# EAGLE design OSO-PYCO-A1-02 (EAGLE 9.6.2)
CHECKED: KTOWN; COMPANY: ADAFRUIT INDUSTRIES; DRAWN: KTOWN; REV: A

## Sheet 1 of 2
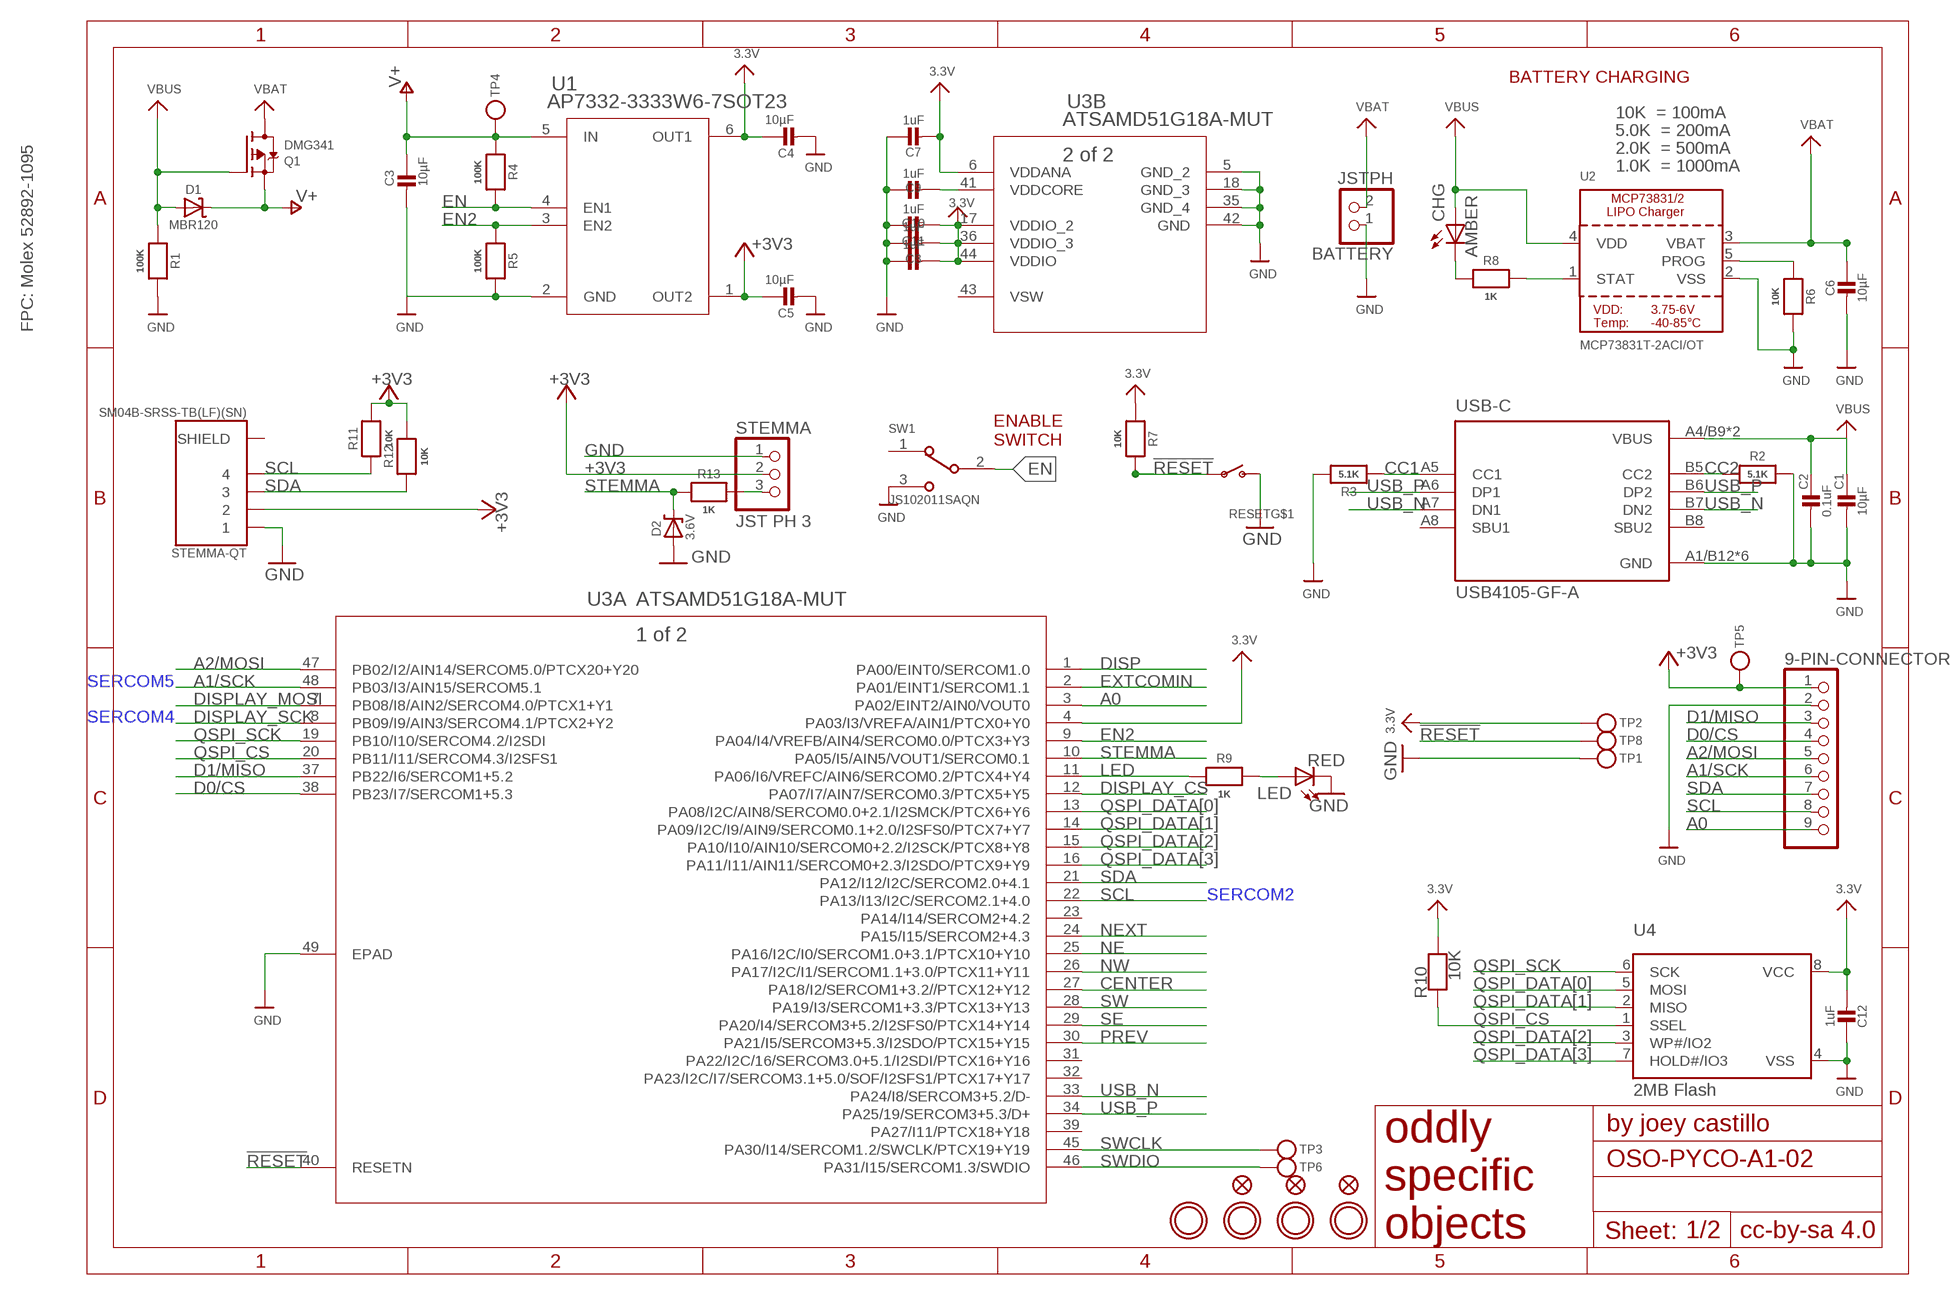
[diagram p0: schematic, sheet 1]

### Parts
9-PIN-CONNECTOR  HEADER-1X9_JSTSH  [JST_SH9]
BATTERY  JSTPH  CON_JST_PH_2PIN  [JSTPH2]
C1  10µF  CAP_CERAMIC0805-NOOUTLINE  [0805-NO]
C2  0.1uF  CAP_CERAMIC_0603MP  [_0603MP]
C3  10µF  CAP_CERAMIC0805-NOOUTLINE  [0805-NO]
C4  10µF  CAP_CERAMIC0805-NOOUTLINE  [0805-NO]
C5  10µF  CAP_CERAMIC0805-NOOUTLINE  [0805-NO]
C6  10µF  CAP_CERAMIC0805-NOOUTLINE  [0805-NO]
C7  1uF  CAP_CERAMIC_0603MP  [_0603MP]
C8  1uF  CAP_CERAMIC_0603MP  [_0603MP]
C9  1uF  CAP_CERAMIC_0603MP  [_0603MP]
C10  1uF  CAP_CERAMIC_0603MP  [_0603MP]
C11  1uF  CAP_CERAMIC_0603MP  [_0603MP]
C12  1uF  CAP_CERAMIC_0603MP  [_0603MP]
CHG  AMBER  LEDCHIP-LED0805  [CHIP-LED0805]
D1  MBR120  DIODE-SCHOTTKYSOD-123  [SOD-123]
D2  3.6V  DIODE-ZENERSOD123  [SOD-123]
FID1  FIDUCIAL_1MM  [FIDUCIAL_1MM]
FID2  FIDUCIAL_1MM  [FIDUCIAL_1MM]
FID3  FIDUCIAL_1MM  [FIDUCIAL_1MM]
LED  RED  LEDCHIP-LED0805  [CHIP-LED0805]
Q1  DMG341  MOSFET-P  [SOT23-R]
R1  100K  RESISTOR_0603MP  [_0603MP]
R2  5.1K  RESISTOR_0603MP  [_0603MP]
R3  5.1K  RESISTOR_0603MP  [_0603MP]
R4  100K  RESISTOR_0603MP  [_0603MP]
R5  100K  RESISTOR_0603MP  [_0603MP]
R6  10K  RESISTOR_0603MP  [_0603MP]
R7  10K  RESISTOR_0603MP  [_0603MP]
R8  1K  RESISTOR_0603MP  [_0603MP]
R9  1K  RESISTOR_0603MP  [_0603MP]
R10  10K  RESISTOR_0603MP  [_0603MP]
R11  10K  RESISTOR_0603MP  [_0603MP]
R12  10K  RESISTOR_0603MP  [_0603MP]
R13  1K  RESISTOR_0603MP  [_0603MP]
RESET  SWITCH_SPSTTL3330A  [TL3330A]
STEMMA  JST PH 3  CON_JST_PH_3PIN  [JSTPH3]
STEMMA-QT  SM04B-SRSS-TB(LF)(SN)  [JST_SM04B-SRSS-TB(LF)(SN)]
SW1  JS102011SAQN  [SW_JS102011SAQN]
TP1  TESTPOINTROUND2MMNO  [TESTPOINT_ROUND_2MM_NO]
TP2  TESTPOINTROUND2MMNO  [TESTPOINT_ROUND_2MM_NO]
TP3  TESTPOINTROUND2MMNO  [TESTPOINT_ROUND_2MM_NO]
TP4  TESTPOINTROUND2MMNO  [TESTPOINT_ROUND_2MM_NO]
TP5  TESTPOINTROUND2MMNO  [TESTPOINT_ROUND_2MM_NO]
TP6  TESTPOINTROUND2MMNO  [TESTPOINT_ROUND_2MM_NO]
TP8  TESTPOINTROUND2MMNO  [TESTPOINT_ROUND_2MM_NO]
U1  AP7332-3333W6-7SOT23  [SOT23-6]
U2  MCP73831T-2ACI/OT  MCP73831/2  [SOT23-5]
U3  ATSAMD51G18A-MUT  [QFN48_7X7MC]
U4  2MB Flash  SPIFLASH_SOIC8  [SOIC8_150MIL]
U$9  MOUNTINGHOLE2.5  [MOUNTINGHOLE_2.5_PLATED]
U$10  MOUNTINGHOLE2.5  [MOUNTINGHOLE_2.5_PLATED]
U$27  MOUNTINGHOLE2.5  [MOUNTINGHOLE_2.5_PLATED]
U$28  MOUNTINGHOLE2.5  [MOUNTINGHOLE_2.5_PLATED]
USB-C  USB4105-GF-A  [GCT_USB4105-GF-A]

### Nets
3.3V [power]: C4.1 C7.2 C8.2 C10.2 C11.2 C12.2 R7.1 R10.2 TP2.P$1 U1.6(OUT1) U3.4(A:PA03/I3/VREFA/AIN1/PTCX0+Y0) U3.6(B:VDDANA) U3.17(B:VDDIO_2) U3.36(B:VDDIO_3) U3.44(B:VDDIO) U4.8(VCC) ; also sheet 2
!RESET: R7.2 RESET.P$1(P) TP8.P$1 U3.40(A:RESETN)
+3V3 [power]: 9-PIN-CONNECTOR.1 C5.1 R11.2 R12.2 STEMMA-QT.2 STEMMA.2 TP5.P$1 U1.1(OUT2)
A0: 9-PIN-CONNECTOR.9 U3.3(A:PA02/EINT2/AIN0/VOUT0)
A1/SCK: 9-PIN-CONNECTOR.6 U3.48(A:PB03/I3/AIN15/SERCOM5.1)
A2/MOSI: 9-PIN-CONNECTOR.5 U3.47(A:PB02/I2/AIN14/SERCOM5.0/PTCX20+Y20)
CC1: R3.1 USB-C.A5(CC1)
CC2: R2.1 USB-C.B5(CC2)
CENTER: U3.27(A:PA18/I2/SERCOM1+3.2//PTCX12+Y12) ; also sheet 2
D0/CS: 9-PIN-CONNECTOR.4 U3.38(A:PB23/I7/SERCOM1+5.3)
D1/MISO: 9-PIN-CONNECTOR.3 U3.37(A:PB22/I6/SERCOM1+5.2)
DISP: U3.1(A:PA00/EINT0/SERCOM1.0) ; also sheet 2
DISPLAY_CS: U3.12(A:PA07/I7/AIN7/SERCOM0.3/PTCX5+Y5) ; also sheet 2
DISPLAY_MOSI: U3.7(A:PB08/I8/AIN2/SERCOM4.0/PTCX1+Y1) ; also sheet 2
DISPLAY_SCK: U3.8(A:PB09/I9/AIN3/SERCOM4.1/PTCX2+Y2) ; also sheet 2
EN: R4.2 SW1.2 U1.4(EN1) ; also sheet 2
EN2: R5.1 U1.3(EN2) U3.9(A:PA04/I4/VREFB/AIN4/SERCOM0.0/PTCX3+Y3)
EXTCOMIN: U3.2(A:PA01/EINT1/SERCOM1.1) ; also sheet 2
GND [gnd]: 9-PIN-CONNECTOR.2 BATTERY.1 C1.2 C2.2 C3.2 C4.2 C5.2 C6.2 C7.1 C8.1 C9.1 C10.1 C11.1 C12.1 D2.A LED.C R1.2 R2.2 R3.2 R5.2 R6.2 RESET.P$2(S) STEMMA-QT.1 STEMMA.1 SW1.3 TP1.P$1 U1.2(GND) U2.2(VSS) U3.5(B:GND_2) U3.18(B:GND_3) U3.35(B:GND_4) U3.42(B:GND) U3.49(A:EPAD) U4.4(VSS) USB-C.A1/B12(GND) USB-C.B1/A12(GND) USB-C.G1(GND) USB-C.G2(GND) USB-C.G3(GND) USB-C.G4(GND) ; also sheet 2
LED: R9.1 U3.11(A:PA06/I6/VREFC/AIN6/SERCOM0.2/PTCX4+Y4)
N$1: LED.A R9.2
N$2: CHG.C R8.1
NE: U3.25(A:PA16/I2C/I0/SERCOM1.0+3.1/PTCX10+Y10) ; also sheet 2
NEXT: U3.24(A:PA15/I15/SERCOM2+4.3) ; also sheet 2
NW: U3.26(A:PA17/I2C/I1/SERCOM1.1+3.0/PTCX11+Y11) ; also sheet 2
PREV: U3.30(A:PA21/I5/SERCOM3+5.3/I2SDO/PTCX15+Y15) ; also sheet 2
PROG: R6.1 U2.5(PROG)
QSPI_CS: R10.1 U3.20(A:PB11/I11/SERCOM4.3/I2SFS1) U4.1(SSEL)
QSPI_DATA[0]: U3.13(A:PA08/I2C/AIN8/SERCOM0.0+2.1/I2SMCK/PTCX6+Y6) U4.5(MOSI)
QSPI_DATA[1]: U3.14(A:PA09/I2C/I9/AIN9/SERCOM0.1+2.0/I2SFS0/PTCX7+Y7) U4.2(MISO)
QSPI_DATA[2]: U3.15(A:PA10/I10/AIN10/SERCOM0+2.2/I2SCK/PTCX8+Y8) U4.3(WP#/IO2)
QSPI_DATA[3]: U3.16(A:PA11/I11/AIN11/SERCOM0+2.3/I2SDO/PTCX9+Y9) U4.7(HOLD#/IO3)
QSPI_SCK: U3.19(A:PB10/I10/SERCOM4.2/I2SDI) U4.6(SCK)
SCL: 9-PIN-CONNECTOR.8 R11.1 STEMMA-QT.4 U3.22(A:PA13/I13/I2C/SERCOM2.1+4.0)
SDA: 9-PIN-CONNECTOR.7 R12.1 STEMMA-QT.3 U3.21(A:PA12/I12/I2C/SERCOM2.0+4.1)
SE: U3.29(A:PA20/I4/SERCOM3+5.2/I2SFS0/PTCX14+Y14) ; also sheet 2
STAT: R8.2 U2.1(STAT)
STEMMA: D2.C R13.2 U3.10(A:PA05/I5/AIN5/VOUT1/SERCOM0.1)
STEMMA_: R13.1 STEMMA.3
SW: U3.28(A:PA19/I3/SERCOM1+3.3/PTCX13+Y13) ; also sheet 2
SWCLK: TP3.P$1 U3.45(A:PA30/I14/SERCOM1.2/SWCLK/PTCX19+Y19)
SWDIO: TP6.P$1 U3.46(A:PA31/I15/SERCOM1.3/SWDIO)
USB_N: U3.33(A:PA24/I8/SERCOM3+5.2/D-) USB-C.A7(DN1) USB-C.B7(DN2)
USB_P: U3.34(A:PA25/19/SERCOM3+5.3/D+) USB-C.A6(DP1) USB-C.B6(DP2)
V+ [power]: C3.1 D1.C Q1.2(S) R4.1 TP4.P$1 U1.5(IN) ; also sheet 2
VBAT [power]: BATTERY.2 C6.1 Q1.3(D) U2.3(VBAT)
VBUS [power]: C1.1 C2.1 CHG.A D1.A Q1.1(G) R1.1 U2.4(VDD) USB-C.A4/B9(VBUS) USB-C.B4/A9(VBUS)
VDDCORE1: C9.2 U3.41(B:VDDCORE)
Unconnected: RESET.P$3(MT) RESET.P$4(MT) STEMMA-QT.S1(SHIELD) STEMMA-QT.S2(SHIELD) SW1.1 U3.23(A:PA14/I14/SERCOM2+4.2) U3.31(A:PA22/I2C/16/SERCOM3.0+5.1/I2SDI/PTCX16+Y16) U3.32(A:PA23/I2C/I7/SERCOM3.1+5.0/SOF/I2SFS1/PTCX17+Y17) U3.39(A:PA27/I11/PTCX18+Y18) USB-C.A8(SBU1) USB-C.B8(SBU2)

### Notes on the sheet
- BATTERY CHARGING
- 10K  = 100mA
- 5.0K  = 200mA
- 2.0K  = 500mA
- 1.0K  = 1000mA
- FPC: Molex 52892-1095
- ENABLE
  SWITCH
- SERCOM5
- SERCOM4
- SERCOM2

## Sheet 2 of 2
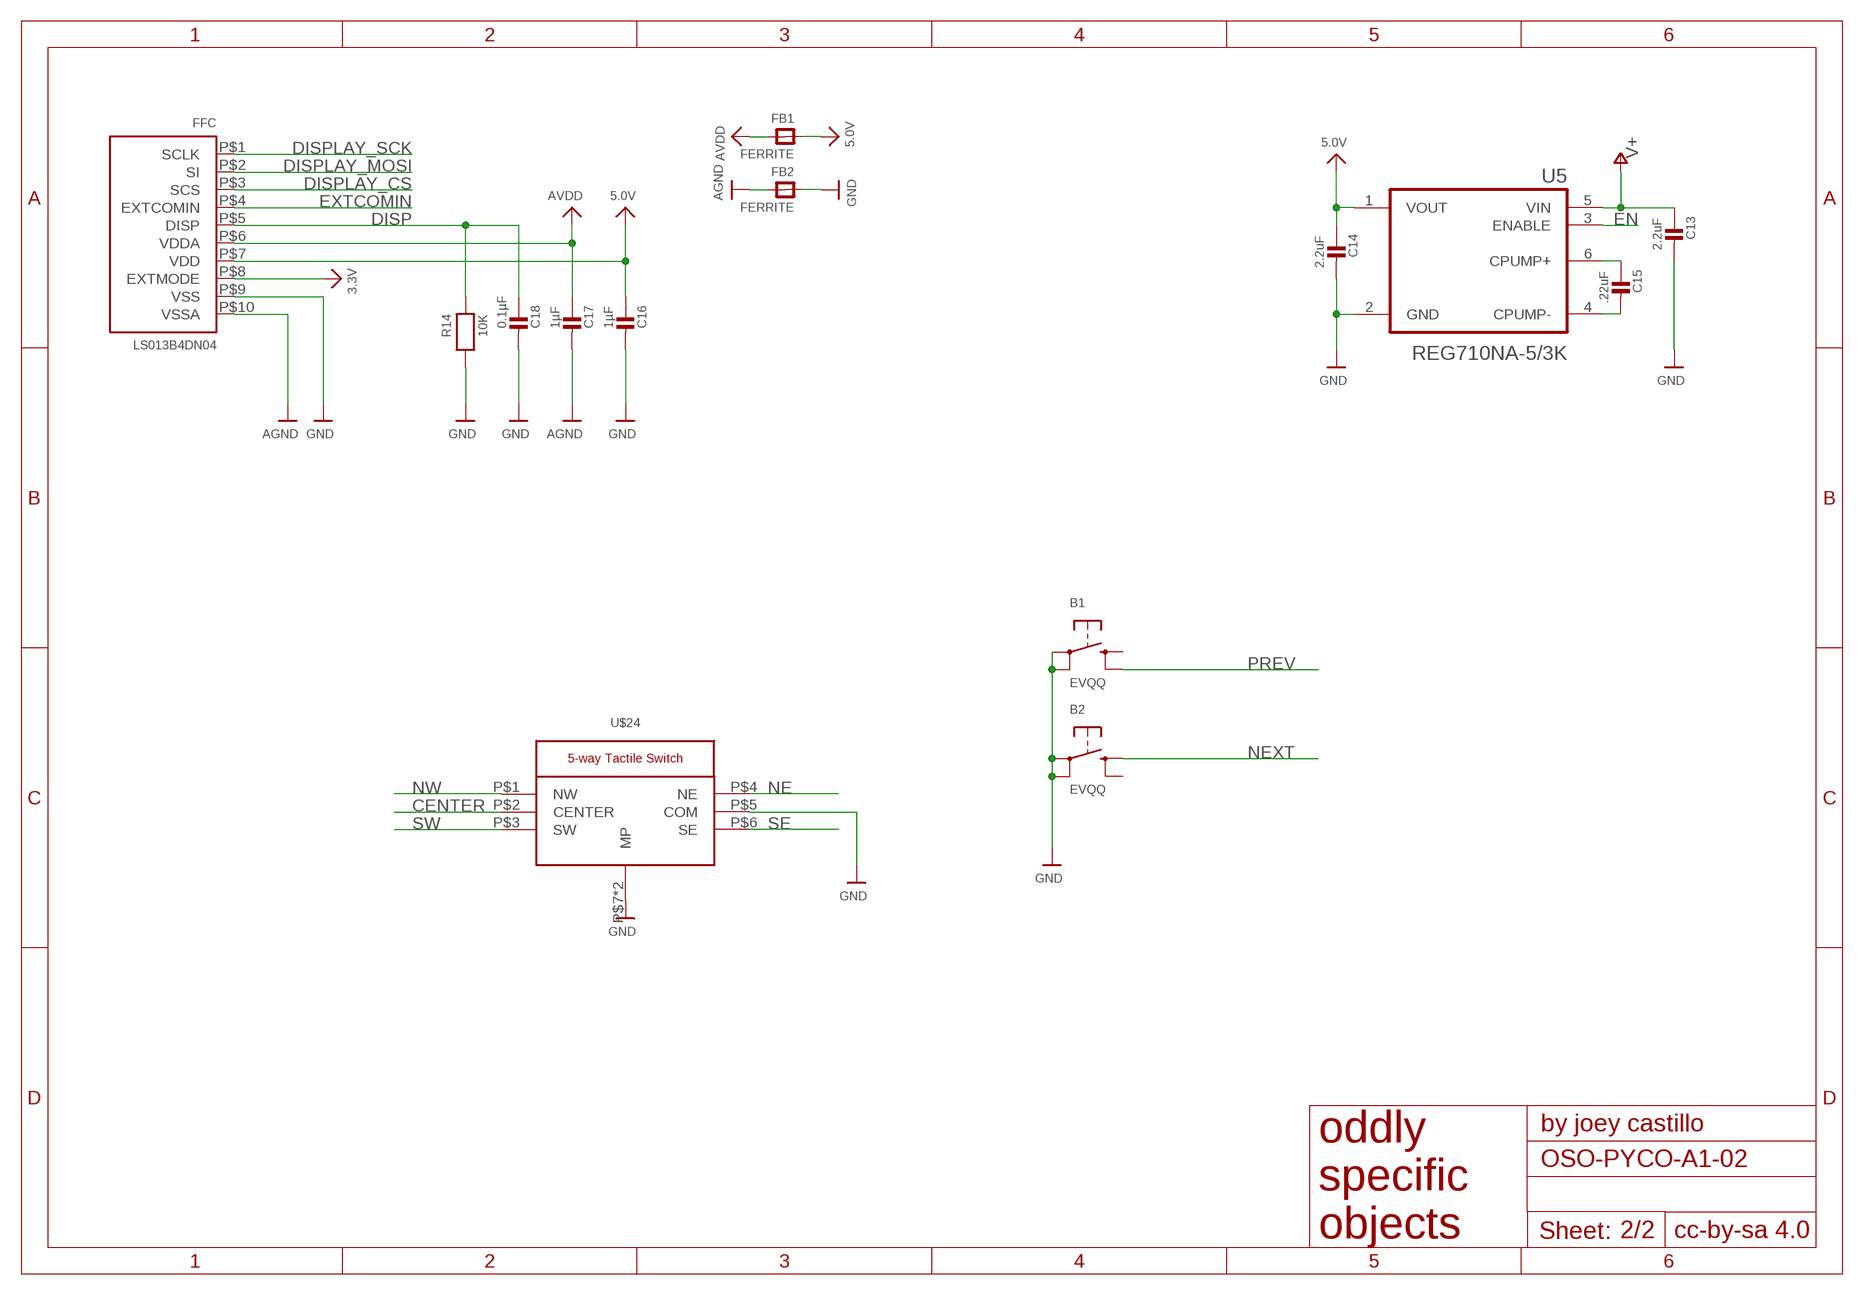
[diagram p1: schematic, sheet 2]

### Parts
B1  EVQQ  SWITCH_TACT_SMT_6MM  [6MMX6MM_TACTILE_SMT]
B2  EVQQ  SWITCH_TACT_SMT_6MM  [6MMX6MM_TACTILE_SMT]
C13  2.2uF  CAP_CERAMIC_0603MP  [_0603MP]
C14  2.2uF  CAP_CERAMIC_0603MP  [_0603MP]
C15  .22uF  CAP_CERAMIC_0603MP  [_0603MP]
C16  1µF  CAP_CERAMIC_0603MP  [_0603MP]
C17  1µF  CAP_CERAMIC_0603MP  [_0603MP]
C18  0.1µF  CAP_CERAMIC_0603MP  [_0603MP]
FB1  FERRITE  FERRITE_0805  [_0805]
FB2  FERRITE  FERRITE_0805  [_0805]
FFC  LS013B4DN04  DISP_EINK_SHARPMEMORYLCD_10PIN_27IN  [SHARP_2.7IN]
R14  10K  RESISTOR_0603MP  [_0603MP]
U5  REG710NA-5/3K  [SOT95P280X145-6N]
U$24  K1-5202UA  [K1-5202UA]

### Nets
3.3V [power]: FFC.P$8(EXTMODE) ; also sheet 1
5.0V [power]: C14.1 C16.1 FB1.1 FFC.P$7(VDD) U5.1(VOUT)
AGND [gnd]: C17.2 FB2.2 FFC.P$10(VSSA)
AVDD [power]: C17.1 FB1.2 FFC.P$6(VDDA)
CENTER: U$24.P$2(CENTER) ; also sheet 1
DISP: C18.1 FFC.P$5(DISP) R14.1 ; also sheet 1
DISPLAY_CS: FFC.P$3(SCS) ; also sheet 1
DISPLAY_MOSI: FFC.P$2(SI) ; also sheet 1
DISPLAY_SCK: FFC.P$1(SCLK) ; also sheet 1
EN: U5.3(ENABLE) ; also sheet 1
EXTCOMIN: FFC.P$4(EXTCOMIN) ; also sheet 1
GND [gnd]: B1.A'(P1) B1.A(P) B2.A'(P1) B2.A(P) C13.2 C14.2 C16.2 C18.2 FB2.1 FFC.P$9(VSS) R14.2 U5.2(GND) U$24.P$5(COM) U$24.P$7(MP) U$24.P$8(MP) ; also sheet 1
N$4: C15.1 U5.6(CPUMP+)
N$5: C15.2 U5.4(CPUMP-)
NE: U$24.P$4(NE) ; also sheet 1
NEXT: B2.B(S) ; also sheet 1
NW: U$24.P$1(NW) ; also sheet 1
PREV: B1.B'(S1) ; also sheet 1
SE: U$24.P$6(SE) ; also sheet 1
SW: U$24.P$3(SW) ; also sheet 1
V+ [power]: C13.1 U5.5(VIN) ; also sheet 1
Unconnected: B1.B(S) B2.B'(S1)

## Power pins joined to a net without a drawn wire
VSW: U3.43(B:VSW)

## Library data of the parts
9-PIN-CONNECTOR = microbuilder:HEADER-1X9: PIN HEADER
B1 B2 = microbuilder:SWITCH_TACT_SMT: SMT Tact Switches 6x6mm - Digikey: P12940SCT-ND KMR2 (4.6x2.8mm) - Digikey: 401-1426-1-ND EVQ-PQHB55 - Light Touch, 160GF (4.5x4.5mm) - Digikey: P8090SCT-ND KMT0 - KMT021 NGJ LHS (etc.) IP68/Waterproof - Digikey: CKN10289CT-ND
BATTERY = microbuilder:CON_JST_PH_2PIN: JST 2-Pin Right-Angle Connector PH-Series - 4UConnector: 17311 SH-Series - 4UConnector: 07278
C1 C2 C6-C12 C16-C18 = microbuilder:CAP_CERAMIC: Ceramic Capacitors For new designs, use the packages preceded by an '_' character since they are more reliable: The following footprints should be used on most boards: _0402 - Standard footprint for regular board layouts _0603 - Standard footprint for regular board layouts _0805 - Standard footprint for regular board layouts _1206 - Standard footprint for regular board layouts For extremely tight-pitch boards where space is at a premium, the following 'micro-pitch' footprints can be used (smaller pads, no silkscreen outline, etc.): _0402MP - Micro-pitch footprint for very dense/compact boards _0603MP - Micro-pitch footprint for very dense/compact boards _0805MP - Micro-pitch footprint for very dense/compact boards _1206MP - Micro-pitch footprint for very dense/compact boards
C3-C5 C13-C15 = microbuilder:CAP_CERAMIC: Ceramic Capacitors For new designs, use the packages preceded by an '_' character since they are more reliable: The following footprints should be used on most boards: _0402 - Standard footprint for regular board layouts _0603 - Standard footprint for regular board layouts _0805 - Standard footprint for regular board layouts _1206 - Standard footprint for regular board layouts For extremely tight-pitch boards where space is at a premium, the following 'micro-pitch' footprints can be used (smaller pads, no silkscreen outline, etc.): _0402MP - Micro-pitch footprint for very dense/compact boards _0603MP - Micro-pitch footprint for very dense/compact boards _0805MP - Micro-pitch footprint for very dense/compact boards _1206MP - Micro-pitch footprint for very dense/compact boards; REV: A
CHG LED = adafruit:LED: LED OSRAM: - CHIPLED LG R971, LG N971, LY N971, LG Q971, LY Q971, LO R971, LY R971 LH N974, LH R974 LS Q976, LO Q976, LY Q976 LO Q996 - Hyper CHIPLED LW Q18S LB Q993, LB Q99A, LB R99A - SideLED LS A670, LO A670, LY A670, LG A670, LP A670 LB A673, LV A673, LT A673, LW A673 LH A674 LY A675 LS A676, LA A676, LO A676, LY A676, LW A676 LS A679, LY A679, LG A679 - Hyper Micro SIDELED® LS Y876, LA Y876, LO Y876, LY Y876 LT Y87S - SmartLED LW L88C, LW L88S LB L89C, LB L89S, LG L890 LS L89K, LO L89K, LY L89K LS L896, LA L896, LO L896, LY L896 - TOPLED LS T670, LO T670, LY T670, LG T670, LP T670 LSG T670, LSP T670, LSY T670, LOP T670, LYG T670 LG T671, LOG T671, LSG T671 LB T673, LV T673, LT T673, LW T673 LH T674 LS T676, LA T676, LO T676, LY T676, LB T676, LH T676, LSB T676, LW T676 LB T67C, LV T67C, LT T67C, LS T67K, LO T67K, LY T67K, LW E67C LS E67B, LA E67B, LO E67B, LY E67B, LB E67C, LV E67C, LT E67C LW T67C LS T679, LY T679, LG T679 LS T770, LO T770, LY T770, LG T770, LP T770 LB T773, LV T773, LT T773, LW T773 LH T774 LS E675, LA E675, LY E675, LS T675 LS T776, LA T776, LO T776, LY T776, LB T776 LHGB T686 LT T68C, LB T68C - Hyper Mini TOPLED® LB M676 - Mini TOPLED Santana® LG M470 LS M47K, LO M47K, LY M47K Source: http://www.osram.convergy.de/
D1 = microbuilder:DIODE-SCHOTTKY
D2 = microbuilder:DIODE-ZENER: Zener Diode SMA: 30V 1W Zener Diode, 1.2Vf - Digikey: SMAZ30-FDICT-ND
FB1 FB2 = microbuilder:FERRITE: Ferrite Bead 0603 MMZ1608B121C - 120 Ohm @ 100MHz, 600mA, 0.15 Ohm DC Resistance - Digikey: 445-2164-1-ND BK1608HW121-T - 120 Ohm, 600mA Ferrite Chip - Digikey: 587-1876-2-ND 0805 HZ0805B272R-10 - 2.7K Ohm @ 100MHz, 200mA, 0.8 Ohm DC Resistance - Digikey: 240-2504-1-ND (see also Murata BLM21BD272SN1L) MMZ2012Y152B - 1.5K Ohm @ 100MHz, 500mA, 0.4 Ohm DC Resistance - Digikey: 445-1560-1-ND - Mainly for high frequency (80-400MHz) MMZ2012R102A - 1K Ohm @ 100MHz, 500mA, 0.3 Ohm DC Resistance - Digikey: 445-1555-2-ND - More general purpose (10-200MHz)
FFC = adafruit_display:DISP_EINK_SHARPMEMORYLCD_10PIN: Sharp Mono Memory LCD LS013B4DN04 - 1.35" 96x96 Pixels LS027B7DH01 - 2.7" 400x240 Pixels FPC Connector: Molex 52892-1095 (WM9203CT-ND)
FID1 FID2 = microbuilder:FIDUCIAL: Fiducial Alignment Points Various fiducial points for machine vision alignment.; BOM: EXCLUDE
FID3 = microbuilder:FIDUCIAL: Fiducial Alignment Points Various fiducial points for machine vision alignment.; BOM: EXCLUDE; REV: A
Q1 = microbuilder:MOSFET-P: P-Channel Mosfet LEGEND VDS: Voltage Drain-Source ID: Drain Current RDS(ON): Drain-Source On-State Resistance VGS(TH): Gate-Source Threshold Voltage CISS: Drain-Source Input Capacitance SOT-23 Name VDS ID RDS(ON) VGS(TH) CISS Order Number IRLML5103 30V 760mA 600 mOhm -- 75pF @ 25V Digikey: IRLML5103PBFCT-ND IRLML6401 12V 4.3A 50 mOhm 950mV @ 250µA 830pF @ 10V Digikey: IRLML6401PBFTR-ND NTR0202PL 20V 400mA 800 mOhm 2.3V @ 250uA 70pF @ 5V Digikey: NTR0202PLT1GOSTR-ND NTR4101PT1G 20V 1.8A 85 mOhm 1.2V @ 250uA 675pF @ 10V Digikey: NTR4101PT1GOSCT-ND DMP2004K 20V 600mA 900 mOhm 1V @ 250uA 175pF @ 16V Digikey: DMP2004KDICT-ND PMV65XP 20V 3.9A 76 mOhm 950mV @ 1mA 725pF @ 20V Digikey: 568-2358-2-ND TO-252 Name VDS ID RDS(ON) VGS(TH) CISS Order Number AOD417 30V 25A 34 mOhm 3V @ 250µA 920pF @ 15V Digikey: 785-1106-2-ND PowerPak Name VDS ID RDS(ON) VGS(TH) CISS Order Number AON7401 30V 12A 14 mOhm 3V @ 250µA 2600pF @ 15V Digikey: 785-1302-1-ND
R1-R14 = microbuilder:RESISTOR: Resistors For new designs, use the packages preceded by an '_' character since they are more reliable: The following footprints should be used on most boards: _0402 - Standard footprint for regular board layouts _0603 - Standard footprint for regular board layouts _0805 - Standard footprint for regular board layouts _1206 - Standard footprint for regular board layouts For extremely tight-pitch boards where space is at a premium, the following 'micro-pitch' footprints can be used (smaller pads, no silkscreen outline, etc.): _0402MP - Micro-pitch footprint for very dense/compact boards _0603MP - Micro-pitch footprint for very dense/compact boards _0805MP - Micro-pitch footprint for very dense/compact boards _1206MP - Micro-pitch footprint for very dense/compact boards
RESET = oddlyspecific:SWITCH_SPST: Switch - SPST 4UCon 19192 (6.7x2.6mm SMT)
STEMMA = microbuilder:CON_JST_PH_3PIN
STEMMA-QT = SM04B-SRSS-TB_LF__SN_:SM04B-SRSS-TB(LF)(SN): SH Series 1.0 mm Pitch 2 Position Single Row Side Entry Shrouded Header; DESCRIPTION: SH Series 1.0 mm Pitch 2 Position Single Row Side Entry Shrouded Header; DIGI-KEY_PART_NUMBER: 455-1804-1-ND; DIGI-KEY_PURCHASE_URL: https://www.digikey.com/product-detail/en/jst-sales-america-inc/SM04B-SRSS-TB_LF__SN_/455-1804-1-ND/926875?utm_source=snapeda&utm_medium=aggregator&utm_campaign=symbol; MF: JST Sales; MP: SM04B-SRSS-TB_LF__SN_; PACKAGE: None
SW1 = JS102011SAQN:JS102011SAQN: JS10 Series SPDT On-On 6 V 0.3 A Gull Wing SMT Slide Switch http://www.snapeda.com/parts/JS102011SAQN/C%26K%20Components/view-part/; DESCRIPTION: Slide Switch SPDT Surface Mount, Right Angle; DIGI-KEY_PART_NUMBER: 401-1999-1-ND; DIGI-KEY_PURCHASE_URL: https://www.digikey.com/product-detail/en/c-k/JS102011SAQN/401-1999-1-ND/1640114?utm_source=snapeda&utm_medium=aggregator&utm_campaign=symbol; MF: C&K; MP: JS102011SAQN; PACKAGE: None
TP1-TP6 TP8 = microbuilder:TESTPOINT: Test Point Various test points for characterisation and PCB testing TESTPOINT_SMT - Compact Surface Mount Test Point [Digikey: 5016KTR-ND]
U1 = My Stuff:AP7332-3333W6-7
U2 = microbuilder:MCP73831/2: MCP73831/2 LIPO Charger VDD: 3.75 - 6V Temp -40 - 85°C Programmable Charge Rate: 15-500mA NOTE: STAT is a tri-state logic output on the MCP73831 and an open-drain output on the MCP73832. SOT23-5 with 4.2V output and tri-state logic on STAT = MCP73831T-2ACI/OT
U3 = ATSAMD51G18AMUT:ATSAMD51G18A-MUT; BUILT_BY: EMA_Molly; COPYRIGHT: Copyright (C) 2018 Accelerated Designs. All rights reserved; MANUFACTURER_PART_NUMBER: ATSAMD51G18A-MUT; VENDOR: Microchip
U4 = microbuilder:SPIFLASH_SOIC8: SOIC8 SPI Flash Be careful with the size since SOIC8 flash comes in several 'widths' SOIC8 150 mil M25P16 - 16Mbit (2Mbit x 8) Serial Flash (75MHz SPI Bus), Supply: 2.7-3.6V Digikey: SOIC8 - M25P16-VMN6P-ND SOIC8 208 mil W25Q16BVSSIG - 16Mbit (2Mbit x 8) Serial Flash (104MHz SPI Bus), Supply: 2.7-3.6V Digikey: SOIC8 - W25Q16BVSSIG-ND
U5 = REG710NA-5_3K:REG710NA-5/3K; DESCRIPTION: 30-mA Switched-Cap DC-DC Converter with fixed 5-V Output 6-SOT-23 -40 to 85; DIGI-KEY_PART_NUMBER: 296-26327-1-ND; MF: Texas Instruments; MP: REG710NA-5/3K; PACKAGE: SOT-23-6 Texas Instruments; PURCHASE-URL: https://pricing.snapeda.com/search/part/REG710NA-5/3K/?ref=eda
U$9 U$10 U$27 U$28 = microbuilder:MOUNTINGHOLE: Mounting Hole For #2 screws (0.086"/2.18mm width, 0.094"/2.4mm hole) use 2.5mm; BOM: EXCLUDE; REV: A
U$24 = K1-5202UA:K1-5202UA
USB-C = USB4105-GF-A:USB4105-GF-A: USB Type C Receptacle for USB 2.0 SMT Type, PCB Top Mount; DESCRIPTION: USB-C (USB TYPE-C) USB 2.0 Receptacle Connector 24 (16+8 Dummy) Position Surface Mount, Right Angle; Through Hole; MF: GCT; MP: USB4105-GF-A; PACKAGE: None; PURCHASE-URL: https://pricing.snapeda.com/search/part/USB4105-GF-A/?ref=eda

## Net classes
1 power: width 0.254 mm, drill 0.254 mm
2 gnd: width 0.254 mm, drill 0.254 mm

## Board
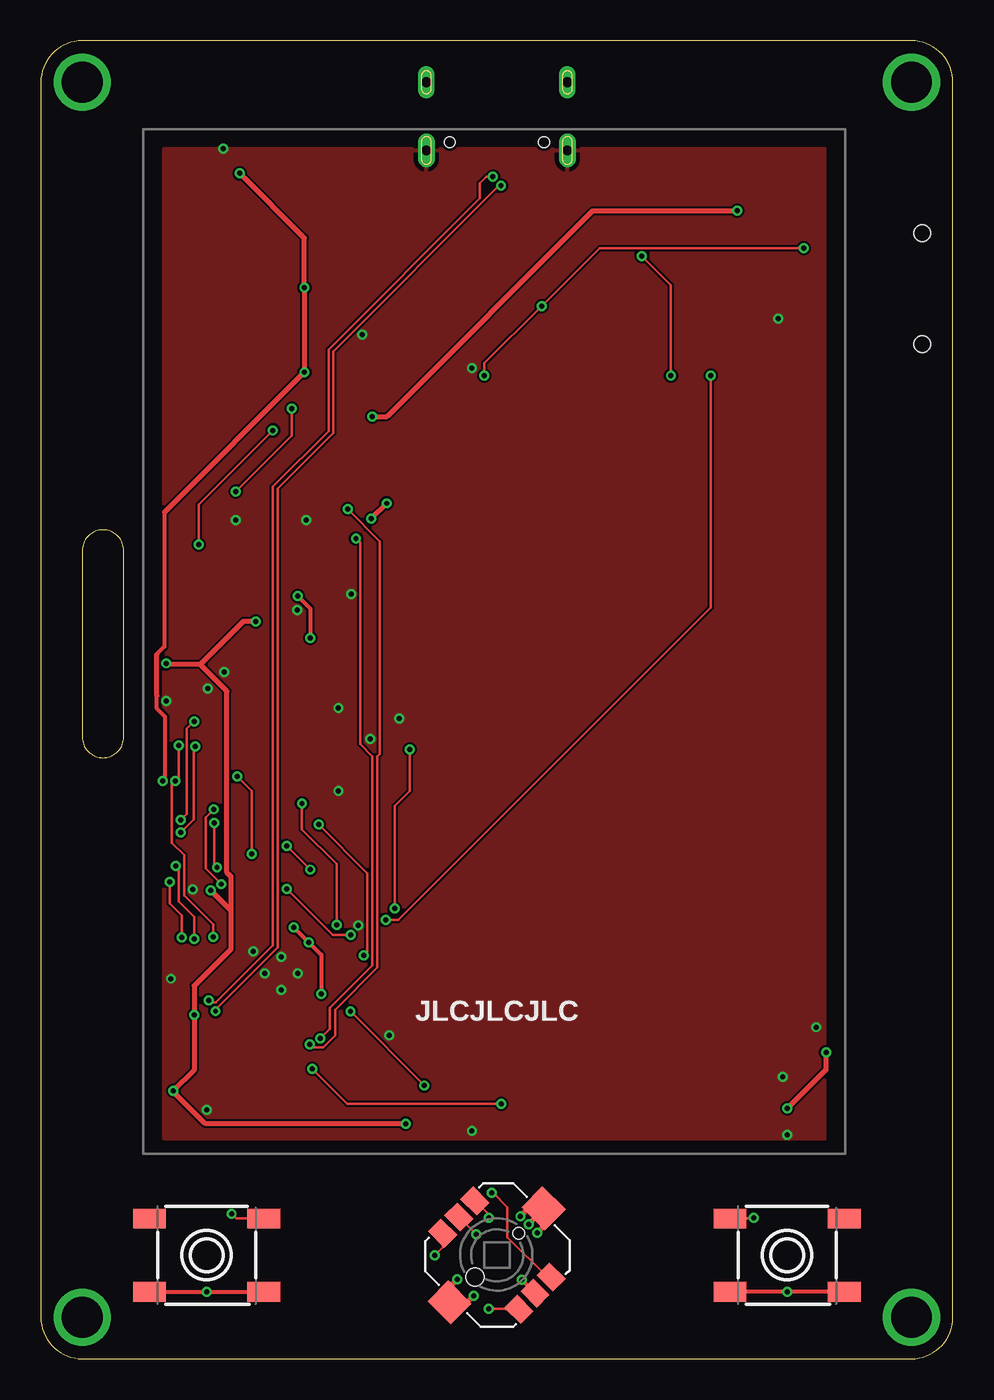
[diagram p2: board, top side]
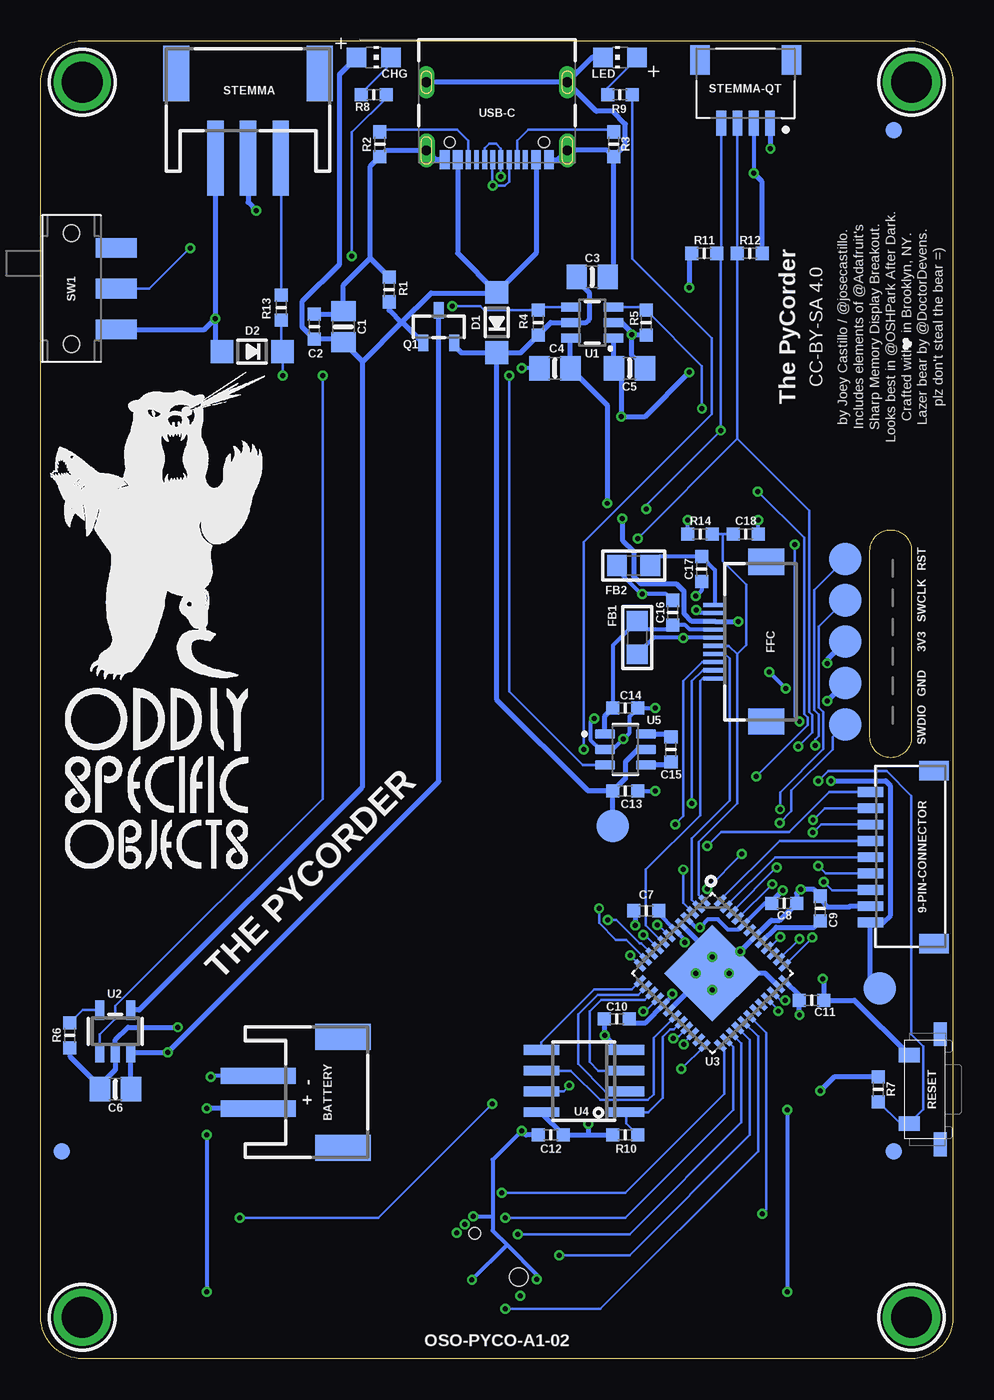
[diagram p3: board, bottom side, seen from below]

Size 55.88 x 80.77 mm. Coordinates in mm from the lower left corner, seen from the top.
Outline: 2.54,0 53.34,0 arc90 55.88,2.54 55.88,78.23 arc90 53.34,80.77 2.54,80.77 arc90 0,78.23 0,2.54 arc90 2.54,0
Outline: 5.08,49.53 arc90 3.81,50.8 arc90 2.54,49.53 2.54,38.1 arc90 3.81,36.83 arc90 5.08,38.1 5.08,49.53
Copper layers (1*16): Top 0.035559375mm / dielectric 1.6mm / Bottom 0.035559375mm
Design rules "jlcpcb2layer *": minimum track width 5mil, minimum drill 12mil, track to track 5mil, track to pad 5mil, pad to pad 5mil, via to via 5mil, smd to smd 5mil, copper to edge 8mil, drill to drill 6mil, minimum pad ring 6mil, minimum via ring 6mil, stop-mask expansion 2.5mil, vias tented up to drill 12mil, thermal gap 10mil
bKeepout: area 24,22.5 to 54.5,59.5; area 26.2,25.3 to 51.2,57.8; area 26.6,23.6 to 50.6,58.6; area 28.1,22.9 to 48.1,58.9; area 29.9,33.7 to 55.3,60.4; area 24,22 to 54.5,33.4

### Footprints (pad centres in the part's own frame; a part is rotated, then mirrored left to right if it is on the bottom)
JST_SH9 = smd 0.6 x 1.55: 1 -4,2.514; 2 -3,2.514; 3 -2,2.514; 4 -1,2.514; 5 0,2.514; 6 1,2.514; 7 2,2.514; 8 3,2.514; 9 4,2.514 | smd 1.2 x 1.8: MT1 -5.3,-1.386; MT2 5.3,-1.386
6MMX6MM_TACTILE_SMT = smd 2 x 1.2: A -3.5,-2.25; A' 3.5,-2.25; B -3.5,2.25; B' 3.5,2.25
JSTPH2 = smd 1 x 4.6: 1 -1,-3.7; 2 1,-3.7 | smd 1.6 x 3.4: NC1 -3.4,1.5; NC2 3.4,1.5
0805-NO = smd 1.24 x 1.5: 1 -0.95,0; 2 0.95,0
_0603MP = smd 0.8 x 0.8: 1 -0.762,0; 2 0.762,0
CHIP-LED0805 = smd 1.2 x 1.2: A 0,-1.05; C 0,1.05
SOD-123 = smd 1.4 x 1.4: A 1.85,0; C -1.85,0
_0805 = smd 1.2 x 1.3: 1 -1.016,0; 2 1.016,0
SHARP_2.7IN = smd 0.25 x 1.4: P$1 -2.25,2.9; P$2 -1.75,2.9; P$3 -1.25,2.9; P$4 -0.75,2.9; P$5 -0.25,2.9; P$6 0.25,2.9; P$7 0.75,2.9; P$8 1.25,2.9; P$9 1.75,2.9; P$10 2.25,2.9 | smd 1.6 x 2.2: SUPPORT1 -4.9,-0.25; SUPPORT2 4.9,-0.25
FIDUCIAL_1MM = smd 1 x 1: 1 0,0
SOT23-R = smd 0.635 x 1.016: 1 -0.95,-1; 2 0.95,-1; 3 0,1
TL3330A = smd 0.9 x 1.27: P$1 -2.1,0.89; P$2 2.1,0.89 | smd 1.45 x 0.8: P$3 -3.375,-1; P$4 3.375,-1
JSTPH3 = smd 1 x 4.6: 1 -2,-2.7; 2 0,-2.7; 3 2,-2.7 | smd 1.6 x 3.4: NC1 -4.4,2.5; NC2 4.4,2.5
JST_SM04B-SRSS-TB(LF)(SN) = smd 0.6 x 1.55: 1 -1.5,0; 2 -0.5,0; 3 0.5,0; 4 1.5,0 | smd 1.2 x 1.8: S1 -2.8,-3.875; S2 2.8,-3.875
SW_JS102011SAQN = smd 1.2 x 2.5: 1 -2.5,2.75; 2 0,2.75; 3 2.5,2.75 | hole 1: -3.4,0; 3.4,0
TESTPOINT_ROUND_2MM_NO = smd 2 x 2: P$1 0,0
SOT23-6 = smd 0.55 x 1.2: 1 0.95,1.3; 2 0,1.3; 3 -0.95,1.3; 4 -0.95,-1.3; 5 0,-1.3; 6 0.95,-1.3
SOT23-5 = smd 0.55 x 1.2: 1 -0.95,-1.3; 2 0,-1.3; 3 0.95,-1.3; 4 0.95,1.3; 5 -0.95,1.3
QFN48_7X7MC = smd 0.813 x 0.305: 1 -3.48,2.794; 2 -3.48,2.286; 3 -3.48,1.778; 4 -3.48,1.27; 5 -3.48,0.762; 6 -3.48,0.254; 7 -3.48,-0.254; 8 -3.48,-0.762; 9 -3.48,-1.27; 10 -3.48,-1.778; 11 -3.48,-2.286; 12 -3.48,-2.794; 25 3.48,-2.794; 26 3.48,-2.286; 27 3.48,-1.778; 28 3.48,-1.27; 29 3.48,-0.762; 30 3.48,-0.254; 31 3.48,0.254; 32 3.48,0.762; 33 3.48,1.27; 34 3.48,1.778; 35 3.48,2.286; 36 3.48,2.794 | smd 0.305 x 0.813: 13 -2.794,-3.48; 14 -2.286,-3.48; 15 -1.778,-3.48; 16 -1.27,-3.48; 17 -0.762,-3.48; 18 -0.254,-3.48; 19 0.254,-3.48; 20 0.762,-3.48; 21 1.27,-3.48; 22 1.778,-3.48; 23 2.286,-3.48; 24 2.794,-3.48; 37 2.794,3.48; 38 2.286,3.48; 39 1.778,3.48; 40 1.27,3.48; 41 0.762,3.48; 42 0.254,3.48; 43 -0.254,3.48; 44 -0.762,3.48; 45 -1.27,3.48; 46 -1.778,3.48; 47 -2.286,3.48; 48 -2.794,3.48 | smd 4.191 x 4.191: 49 0,0
SOIC8_150MIL = smd 0.6 x 2.2: 1 -1.905,-2.6; 2 -0.635,-2.6; 3 0.635,-2.6; 4 1.905,-2.6; 5 1.905,2.6; 6 0.635,2.6; 7 -0.635,2.6; 8 -1.905,2.6
SOT95P280X145-6N = smd 1.21 x 0.58: 1 -1.255,0.95; 2 -1.255,0; 3 -1.255,-0.95; 4 1.255,-0.95; 5 1.255,0; 6 1.255,0.95
MOUNTINGHOLE_2.5_PLATED = drill 2.5 pad 3.2: P$1 0,0
K1-5202UA = smd 1.4 x 1.1: P$1 -3.3,1.4; P$2 -3.3,0; P$3 -3.3,-1.4; P$4 3.3,1.4; P$5 3.3,0; P$6 3.3,-1.4 | smd 2 x 1.8: P$7 0,-4.1; P$8 0,4.05 | hole 1.1: 0,-1.9 | hole 0.7: 0,1.9
GCT_USB4105-GF-A = smd 0.6 x 1.15: A1/B12 -3.2,4.755; A4/B9 -2.4,4.755; B1/A12 3.2,4.755; B4/A9 2.4,4.755 | smd 0.3 x 1.15: A5 -1.25,4.755; A6 -0.25,4.755; A7 0.25,4.755; A8 1.25,4.755; B5 1.75,4.755; B6 0.75,4.755; B7 -0.75,4.755; B8 -1.75,4.755 | drill 0.6 pad 1 long: G1 -4.32,0; G2 4.32,0 | drill 0.6 pad 1.05 long: G3 -4.32,4.18; G4 4.32,4.18 | hole 0.65: 2.89,3.68; -2.89,3.68

### Placement (x,y rotation side)
9-PIN-CONNECTOR  2.54,30.73 90 bottom
B1  10.16,6.35 0 top
B2  45.72,6.35 0 top
BATTERY  38.86,16.33 270 bottom
C1  37.34,63.25 90 bottom
C2  39.12,63.25 90 bottom
C3  22.1,66.29 0 bottom
C4  24.38,60.71 180 bottom
C5  19.81,60.71 0 bottom
C6  51.31,16.51 180 bottom
C7  18.8,27.46 0 bottom
C8  10.34,27.91 180 bottom
C9  8.13,27.58 270 bottom
C10  20.6,20.83 0 bottom
C11  8.66,21.97 180 bottom
C12  24.64,13.72 0 bottom
C13  20.07,34.8 0 bottom
C14  20.07,39.88 0 bottom
C15  17.27,37.34 270 bottom
C16  17.17,45.72 90 bottom
C17  15.4,48.39 90 bottom
C18  12.7,50.55 0 bottom
CHG  35.48,79.76 270 bottom
D1  27.94,63.5 90 bottom
D2  42.93,61.72 180 bottom
FB1  19.33,44.2 270 bottom
FB2  19.56,48.61 0 bottom
FFC  11.68,43.94 90 bottom
FID1  3.63,12.7 0 bottom
FID2  54.61,12.7 0 bottom
FID3  3.63,75.29 0 bottom
LED  20.4,79.76 90 bottom
Q1  31.5,63.25 0 bottom
R1  34.54,65.53 90 bottom
R2  35.1,74.42 270 bottom
R3  20.78,74.42 270 bottom
R4  25.4,63.5 90 bottom
R5  18.8,63.5 270 bottom
R6  54.1,19.81 270 bottom
R7  4.57,16.51 270 bottom
R8  35.48,77.47 0 bottom
R9  20.4,77.47 180 bottom
R10  20.07,13.72 180 bottom
R11  15.24,67.74 180 bottom
R12  12.45,67.74 0 bottom
R13  41.15,64.41 270 bottom
R14  15.49,50.55 180 bottom
RESET  1.78,16.51 90 bottom
STEMMA  43.18,76.28 0 bottom
STEMMA-QT  12.7,75.72 180 bottom
SW1  54,65.58 270 bottom
TP1  6.6,41.4 90 bottom
TP2  6.6,43.94 90 bottom
TP3  6.6,46.48 90 bottom
TP4  20.83,32.66 0 bottom
TP5  4.47,22.71 0 bottom
TP6  6.6,38.86 90 bottom
TP8  6.6,49.02 90 bottom
U1  22.1,63.5 270 bottom
U2  51.31,20.07 0 bottom
U3  14.73,23.62 315 bottom
U4  22.61,17.02 90 bottom
U5  20.07,37.34 0 bottom
U$9  2.54,78.23 180 bottom
U$10  53.34,78.23 180 bottom
U$16  [OSO_WORDMARK_THREELINE_450MIL_1000DPI]  48.77,35.56 0 bottom
U$24  27.94,6.35 315 top
U$27  53.34,2.54 90 bottom
U$28  2.54,2.54 270 bottom
U$67  [OSO_BEAR_525X750MIL_1000DPI]  48.77,51.05 0 bottom
USB-C  27.94,78.23 180 bottom

### Tracks (layer width: path | path; a pad name or v marks a point on that pad's centre or on a via)
3.3V  (via drill 0.3)
  Top 0.254: v17.19,22.37 17.19,24.76 v16.43,25.52 v16.42,25.52 v15.49,26.44
  Top 0.305: v22.35,14.41 10.08,14.41 8.13,16.36 v8.13,16.41 9.4,17.68 v9.4,21.08 9.4,22.86 11.66,25.12 11.66,27.46 11.65,27.46 | v10.41,28.7 11.65,27.46 | 9.77,42.55 11.41,40.92 11.41,29.81 11.65,29.57 11.65,27.46 | v13.16,45.19 12.41,45.19 9.77,42.55 | 9.77,42.55 7.76,42.55 v7.7,42.62 | v21.18,52.42 v20.25,51.49
  Bottom 0.254: C7.2 18.03,27.28 U3.6 16.43,25.67 v16.43,25.52 | C8.2 11.52,27.92 U3.44 13.14,26.29 13.77,26.29 14.4,26.92 15.01,26.92 v15.49,26.44 15.76,26.44 U3.4 | 20.23,51.47 v20.25,51.49 | C10.2 19.58,20.57 19.56,20.57 | U3.17 17.19,22.25 v17.19,22.37
  Bottom 0.305: U3.36 9.42,22.27 C11.2 9.42,21.11 v9.4,21.08 | 19.56,20.57 18.86,20.57 U3.17 | U4.8 25.21,15.05 C12.2 22.35,13.72 | 22.35,13.72 R10.2 | C8.2 11.1,28.02 v10.41,28.7 | v22.35,14.41 22.35,13.72 | TP2.P$1 7.7,42.85 v7.7,42.62 | U1.6 23.43,62.51 C4.1 21.18,58.45 v21.18,52.42 | 20.23,51.47 20.23,50.12 19.57,49.47 19.57,47.94 19.12,47.5 16.96,47.5 16.47,47.01 16.47,45.68 15.99,45.19 FFC.P$8 v13.16,45.19 | v8.13,16.41 7.27,17.27 R7.1
5.0V
  Bottom 0.254: C14.1 20.83,43.72 FB1.1 18.81,44.69 17.02,44.69 17.17,44.85 C16.1 16.39,44.96 16.13,44.69 FFC.P$7
  Bottom 0.305: U5.1 21.32,39.39 C14.1
!RESET  (via drill 0.3)
  Top 0.152: v10.57,25.86 10.57,26.62 8.79,28.4 8.79,30.86 8.04,31.61 8.04,35.22 v8.24,35.42 8.44,35.62 v8.44,37.59
  Bottom 0.152: R7.2 3.23,14.41 RESET.P$1 1.8,15.27 1.8,19.16 2.54,19.89 2.54,34.5 4.06,36.03 7.64,36.03 v8.24,35.42 | U3.40 11.24,25.19 v10.57,25.86 | TP8.P$1 8.51,47.12 8.51,39.77 8.23,39.49 8.23,38.18 8.44,37.96 v8.44,37.59
+3V3  (via drill 0.3)
  Top 0.254: 7.57,51.87 7.57,43.64 7.11,43.18 | v7.47,35.42 7.62,35.57 7.62,39.34 7.11,39.85 7.11,40.64
  Top 0.305: v42.67,70.36 33.82,70.36 21.21,57.75 v20.31,57.75 | 7.11,40.64 7.11,43.18 | v12.19,72.64 16.15,68.68 v16.15,65.63 v16.15,60.45 7.57,51.87
  Bottom 0.254: STEMMA-QT.2 v12.2,72.65 v12.19,72.64 | 20.31,57.91 v20.31,57.75
  Bottom 0.305: STEMMA.2 43.18,70.87 v42.67,70.36 | R12.2 11.68,72.14 v12.2,72.65 | R11.2 16.15,67.59 v16.15,65.63 | v7.47,35.42 4.13,35.42 3.81,35.1 3.81,27.18 4.25,26.73 9-PIN-CONNECTOR.1 5.05,23.29 TP5.P$1 | v20.31,57.75 18.86,57.75 v16.15,60.45 | 20.31,57.91 20.31,60.25 C5.1 20.8,60.74 U1.1
A0  (via drill 0.3)
  Top 0.152: v16.51,29.97 v15.06,31.42
  Bottom 0.152: U3.3 16.52,27.93 16.52,29.96 v16.51,29.97 | 9-PIN-CONNECTOR.9 7.58,34.73 10.03,32.28 14.2,32.28 v15.06,31.42
A1/SCK
  Bottom 0.152: 9-PIN-CONNECTOR.6 10.62,31.73 14.25,28.11 U3.48
A2/MOSI
  Bottom 0.152: U3.47 13.89,27.74 10.9,30.73 9-PIN-CONNECTOR.5
AGND
  Bottom 0.254: FFC.P$10 14.58,48.34 C17.2 18.01,49.15 FB2.2
AVDD  (via drill 0.3)
  Top 0.254: v15.75,46.74 16.51,45.97 v16.51,44.16
  Bottom 0.254: FFC.P$6 16.51,44.19 | 16.51,44.19 18.32,44.19 FB1.2 | C17.1 15.4,47.09 v15.75,46.74 | v16.51,44.16 16.51,44.19
CC1
  Bottom 0.152: R3.1 20.92,75.33 26.01,75.33 26.69,74.66 USB-C.A5
CC2
  Bottom 0.152: R2.1 34.95,75.33 30.38,75.33 29.69,74.65 USB-C.B5
CENTER  (via drill 0.3)
  Top 0.152: U$24.P$2 v26.67,7.62 | v26.67,7.62
  Bottom 0.152: v26.67,7.62 19.81,7.62 12.95,14.48 12.95,19.33 U3.27
D0/CS  (via drill 0.3)
  Top 0.152: v8.26,30.2 8.46,30 8.46,28.02 9.4,27.08 v9.4,25.73
  Bottom 0.152: 9-PIN-CONNECTOR.4 7.79,29.73 v8.26,30.2 | U3.38 v9.4,25.72 v9.4,25.73
D1/MISO  (via drill 0.3)
  Top 0.152: v8.62,25.83 8.62,27.18 7.91,27.89 v7.91,29.21
  Bottom 0.152: U3.37 8.62,25.78 v8.62,25.83 | v7.91,29.21 7.39,28.7 5.59,28.7 5.56,28.73 9-PIN-CONNECTOR.3
DISP
  Bottom 0.152: C18.1 14.1,50.55 | 14.1,50.55 R14.1 | U3.1 15.57,28.41 15.57,31.67 13.21,34.04 13.21,43.18 | FFC.P$5 13.72,43.69 13.21,43.18 | 13.21,43.18 12.65,43.74 12.65,47.45 14.1,48.9 14.1,50.55
DISPLAY_CS  (via drill 0.3)
  Top 0.152: v19.78,24.71 20.01,24.94 20.01,29.75 v17.02,32.74
  Bottom 0.152: FFC.P$3 15.35,42.69 16.51,41.53 16.51,33.25 v17.02,32.74 | U3.12 v19.78,24.71
DISPLAY_MOSI  (via drill 0.3)
  Top 0.152: v18.12,26.58 18.12,30.32 16,32.44 v16,34.04
  Bottom 0.152: U3.7 18.05,26.58 v18.12,26.58 | FFC.P$2 15.34,42.19 16,41.53 v16,34.04
DISPLAY_SCK
  Bottom 0.152: FFC.P$1 15.33,41.69 15.49,41.53 15.49,33.3 18.82,29.97 18.82,26.56 17.8,25.54 U3.8
EN  (via drill 0.3)
  Top 0.152: v46.74,68.07 34.24,68.07 v30.68,64.52 27.18,61.01 v27.18,60.25
  Bottom 0.152: U1.4 25.21,64.45 R4.2 28.7,64.26 28.96,64.52 v30.68,64.52 | SW1.2 49.25,65.58 46.76,68.07 v46.74,68.07 | U5.3 22.67,36.39 27.18,40.89 v27.18,60.25
EN2  (via drill 0.3)
  Top 0.152: v12.04,35.69 12.93,34.8 v12.93,30.94 | v15.37,58.24 15.37,56.59 v11.94,53.16 | v15.06,28.8 17.88,25.98 v18.98,25.98
  Bottom 0.152: U1.3 18.98,64.45 R5.1 15.37,60.84 v15.37,58.24 | U3.9 18.89,25.98 v18.98,25.98 | v15.06,28.8 v12.93,30.94 | v12.04,35.69 8.89,38.84 8.89,39.29 9.12,39.52 9.12,50.33 v11.94,53.16
EXTCOMIN
  Bottom 0.152: U3.2 16,28.13 16,31.88 13.68,34.21 13.68,42.9 13.97,43.19 FFC.P$4
GND  (via drill 0.3)
  Top 0.254: B1.A v10.16,4.1 B1.A' | B2.A' v45.72,4.1 B2.A | U$24.P$5 v29.46,4.83
  Top 0.305: U$24.P$8 30.8,9.14 v29.9,8.23 | U$24.P$8 29.86,9.21 v29.39,8.74 | U$24.P$8 30.8,8.12 v30.4,7.72 | v25.5,4.88 25.04,4.42 U$24.P$7 26.11,3.45 v26.52,3.86
  Bottom 0.254: FB2.1 20.57,48.34 19.1,46.86 v19.03,46.86 17.55,46.86 C16.2 | C18.2 v11.94,51.41 | FFC.P$9 15.67,45.69 15.72,45.75 v15.72,45.87 | C13.2 v18.24,34.8 | v18.24,39.88 C14.2 19.81,39.37 19.81,38.35 v20.19,37.97 20.83,37.34 U5.2 21.62,37.34 22.21,37.93 22.21,39.01 v21.97,39.24 | C5.2 19.69,61.53 | C4.2 v26.42,60.71 | v45.72,13.72 v45.72,4.1 | BATTERY.1 45.41,17.33 v45.47,17.27 | 28.19,8.74 28.19,12.19 v26.42,13.97 | v10.16,15.24 v10.16,4.1 | R14.2 v16.26,51.41 | v29.39,8.74 28.19,8.74 | 27.32,6.97 25.5,5.16 v25.5,4.88 | 28.19,8.74 28.19,7.85 27.32,6.97 | v29.46,4.83 27.32,6.97 | v11.25,42.09 v10.24,41.07
  Bottom 0.305: U3.35 11.5,23.62 v13.72,23.62 13.72,24.28 v13.03,24.97 U3.42 11.12,26.87 10.62,26.87 C8.1 9.58,28.52 v9.32,28.77 8.53,28.77 8.13,28.37 C9.1 8.13,28.14 7.66,27.66 6.38,27.66 6.31,27.73 9-PIN-CONNECTOR.2 | U3.5 14.73,24.7 v14.73,24.64 U3.49 | v15.75,23.62 15.42,23.29 U3.18 | C12.1 26.16,13.72 v26.42,13.97 | U4.4 20.46,18.92 21.34,19.8 v21.34,19.81 21.36,19.84 C10.1 | C7.1 19.46,27.36 v19.46,26.56 | USB-C.A1/B12 24.2,73.48 USB-C.G3 21.17,74.05 R3.2 | USB-C.B1/A12 31.69,73.48 USB-C.G4 34.71,74.05 R2.2 35.69,73.08 35.69,67.44 | v47.5,20.32 50.55,20.32 51.31,19.56 U2.2 51.31,17.71 52.26,16.76 C6.2 52.26,16.7 54.1,18.54 R6.2 | R5.2 19.69,62.74 v19.69,62.76 | v19.69,62.76 19.69,62.9 20.29,63.5 U1.2 | STEMMA.1 v45.18,63.76 v45.19,63.75 | v45.19,63.75 45.19,62.13 D2.A | C2.2 37.53,64.01 C1.2 37.34,65.79 35.69,67.44 | 19.69,61.53 v19.69,62.76 | STEMMA-QT.1 11.2,74.19 v11.18,74.17 | R1.2 35.69,67.44 | v45.19,63.75 45.86,63.08 SW1.3 | RESET.P$2 6.03,21.97 C11.1 7.9,23.22 v7.98,23.29 | LED.C 22.1,79.76 USB-C.G1 | C3.2 20.78,66.67 R3.2 | TP1.P$1 v7.7,40.31 | USB-C.G1 USB-C.G2 | R3.2 20.07,74.37 20.07,75.67 20.85,76.45 21.84,76.45 USB-C.G1
  other vias: 14.73,22.61
  pour Top: 7.57,74.17 48.01,74.17 48.01,13.46 7.57,13.46
LED  (via drill 0.3)
  Top 0.152: v22.61,37.34 22.61,34.8 21.68,33.87 v21.68,27.6
  Bottom 0.152: R9.1 19.63,67.41 14.78,62.56 14.78,57.89 22.61,50.06 v22.61,37.34 | U3.11 20.02,25.68 20.65,25.68 21.68,26.71 v21.68,27.6
N$1
  Bottom 0.152: LED.A 19.35,79.71 21.16,77.9 R9.2
N$2
  Bottom 0.152: CHG.C 34.43,79.36 36.25,77.55 R8.1
N$4
  Bottom 0.305: U5.6 17.46,38.29 C15.1
N$5
  Bottom 0.305: C15.2 17.46,36.39 U5.4
NE  (via drill 0.3)
  Top 0.152: v27.64,10.16 27.71,10.16 28.59,9.28 28.59,7.45 31.03,5.01 U$24.P$4
  Bottom 0.152: v27.64,10.16 20.07,10.16 13.99,16.23 13.99,18.93 U3.25
NEXT  (via drill 0.3)
  Top 0.152: B2.B 43.65,8.6 v43.69,8.64 | v28.22,15.62 18.77,15.62 v16.64,17.76
  Bottom 0.152: v43.69,8.64 35.2,8.64 v28.22,15.62 | v16.64,17.76 U3.24
NW  (via drill 0.3)
  Top 0.152: U$24.P$1 27.43,8.84 v27.43,8.64
  Bottom 0.152: v27.43,8.64 20.07,8.64 13.46,15.24 13.46,19.12 U3.26
PREV  (via drill 0.3)
  Top 0.152: B1.B' 11.97,8.6 v11.68,8.89
  Bottom 0.152: U3.30 11.43,19.96 11.43,9.14 v11.68,8.89
PROG
  Bottom 0.152: U2.5 53.31,21.37 R6.1
QSPI_CS
  Bottom 0.152: R10.1 20.01,14.42 U4.1 18.67,15.11 17.78,16 17.78,19.73 17.33,20.18 17.1,20.18 U3.20
QSPI_DATA[0]
  Bottom 0.152: U3.13 19.68,22.63 21.97,22.63 25.21,19.4 U4.5
QSPI_DATA[1]
  Bottom 0.152: U3.14 19.28,22.31 21.76,22.31 22.96,21.11 22.96,18.06 21.29,16.38 U4.2
QSPI_DATA[2]
  Bottom 0.152: U4.3 21.72,17.65 22.25,18.19 22.25,21.29 21.55,21.99 18.88,21.99 U3.15
QSPI_DATA[3]  (via drill 0.3)
  Top 0.152: v23.5,16.74 23.5,16.76 v18.97,21.29
  Bottom 0.152: U4.7 23.85,16.38 v23.5,16.74 | v18.97,21.29 18.96,21.3 18.85,21.3 U3.16
QSPI_SCK
  Bottom 0.152: U4.6 23.42,17.65 21.62,15.85 18.69,15.85 18.34,16.21 18.34,19.66 U3.19
SCL  (via drill 0.3)
  Top 0.152: v8.57,33.01 8.95,33.39 8.95,38.62 v9.4,39.07 | v14.22,56.9 9.68,52.35 v9.68,49.9 | v18.8,52.07 20.78,50.09 20.78,37.06 20.62,36.91 20.62,23.98 18.03,21.39 18.03,19.82 17.3,19.08 16.65,19.08 v16.48,19.25
  Bottom 0.152: 9-PIN-CONNECTOR.8 7.85,33.73 v8.57,33.01 | v16.48,19.25 16.46,19.28 16.46,19.38 U3.22 | STEMMA-QT.4 14.2,68.05 R11.1 14.22,67.49 v14.22,56.9 18.8,52.32 v18.8,52.07 | v9.4,39.07 9.68,39.35 v9.68,49.9
SDA  (via drill 0.3)
  Top 0.152: v9.47,37.52 9.37,37.41 9.37,33.05 v8.57,32.25 | v17.13,19.64 17.71,20.23 17.71,21.5 20.31,24.1 20.31,36.92 19.56,37.67 19.56,50.02 v19.31,50.27
  Bottom 0.152: 9-PIN-CONNECTOR.7 8.07,32.73 8.55,32.25 v8.57,32.25 | U3.21 16.8,19.76 17.02,19.76 v17.13,19.64 | STEMMA-QT.3 R12.1 | R12.1 | R12.1 13.2,56.9 13.2,56.38 | v9.47,37.52 8.61,38.38 8.61,39.44 8.81,39.65 8.81,51.99 13.2,56.38 | v19.31,50.27 13.2,56.38
SE  (via drill 0.3)
  Top 0.152: v27.43,3.05 29.26,3.05 U$24.P$6
  Bottom 0.152: v27.43,3.05 21.59,3.05 11.94,12.7 11.94,19.75 U3.29
STAT  (via drill 0.3)
  Top 0.152: v36.83,67.56 38.61,65.79 v38.61,60.25
  Bottom 0.152: U2.1 52.26,19.88 51.31,20.83 51.31,21.62 38.61,34.32 v38.61,60.25 | R8.2 34.66,77.41 34.66,77.32 36.83,75.16 v36.83,67.56
STEMMA  (via drill 0.3)
  Top 0.152: v21.13,26.9 21.9,26.9 41.05,46.05 v41.05,60.25
  Bottom 0.152: R13.2 41.15,61.79 D2.C 41.05,61.72 v41.05,60.25 | U3.10 19.09,25.46 19.19,25.46 20.62,26.9 v21.13,26.9
STEMMA_
  Bottom 0.152: R13.1 41.15,73.54 STEMMA.3
SW  (via drill 0.3)
  Top 0.152: v24.13,6.35 24.62,6.84 U$24.P$3
  Bottom 0.152: v24.13,6.35 19.81,6.35 12.45,13.72 12.45,19.54 U3.28
SWCLK  (via drill 0.3)
  Top 0.152: v10.59,33.68 10.59,33.66 10.11,33.17 10.11,30.04 v11.07,29.08
  Bottom 0.152: U3.45 v11.07,29.08 | TP3.P$1 8.2,44.88 8.2,39.9 7.94,39.63 7.94,37.37 10.59,34.71 v10.59,33.68
SWDIO  (via drill 0.3)
  Top 0.152: v10.62,32.84 10.62,30.28 v10.8,30.1
  Bottom 0.152: v10.8,30.1 10.82,30.1 13.53,27.39 U3.46 | v10.62,32.84 9.89,33.57 9.89,34.81 7.37,37.34 7.37,38.1 TP6.P$1
USB_N  (via drill 0.3)
  Top 0.152: v10.7,21.3 10.7,21.38 14.53,25.2 14.53,53.34 17.91,56.72 17.91,61.73 28.06,71.88 v28.19,71.88
  Bottom 0.152: v10.7,21.3 10.7,21.39 U3.33 | USB-C.A7 28.21,73.46 28.21,71.9 v28.19,71.88 27.44,71.88 27.19,72.14 USB-C.B7
USB_P  (via drill 0.3)
  Top 0.152: v10.28,21.96 10.4,21.83 10.73,21.83 14.22,25.32 14.22,53.44 17.63,56.84 17.63,61.84 26.89,71.11 26.89,72.04 27.3,72.45 v27.7,72.45
  Bottom 0.152: v10.28,21.96 10.55,21.96 U3.34 | v27.7,72.45 27.69,72.46 USB-C.A6 27.69,74.17 27.99,74.47 28.4,74.47 28.69,74.18 USB-C.B6
V+
  Bottom 0.305: Q1.2 30.55,62.09 30.11,61.65 D1.C | D1.C 26.49,61.65 R4.1 24.64,63.5 U1.5 22.49,63.5 22.29,63.7 22.29,65.35 23.05,66.1 C3.1 | D1.C 27.94,40.39 22.35,34.8 C13.1 | U5.5 19.3,37.34 20.07,36.58 20.07,35.56 C13.1 | TP4.P$1 C13.1
VBAT  (via drill 0.3)
  Top 0.305: v45.72,15.34 48.11,17.73 v48.11,18.77
  Bottom 0.305: BATTERY.2 45.71,15.33 v45.72,15.34 | C6.1 U2.3 v48.11,18.77 31.5,35.38 Q1.3
VBUS
  Bottom 0.305: USB-C.B4/A9 30.34,67.75 D1.A | USB-C.A4/B9 25.54,67.75 D1.A | D1.A 27.98,65.31 31.97,65.31 33.78,63.5 | 33.78,63.5 36.2,61.09 | 36.2,61.09 36.2,35.02 49.85,21.37 U2.4 | CHG.A 37.59,78.7 37.59,67.06 39.88,64.77 39.88,63.25 C2.1 37.53,62.48 C1.1 36.2,61.15 36.2,61.09 | Q1.1 33.7,63.5 33.78,63.5 | R1.1 34.54,64.26 33.78,63.5
VDDCORE1
  Bottom 0.305: U3.41 10.84,26.44 8.51,26.44 C9.2

### Text on the board
tPlace: JLCJLCJLC
bPlace: by Joey Castillo / @josecastillo. / Includes elements of @Adafruit's / Sharp Memory Display Breakout. / Looks best in @OSHPark After Dark. / Crafted with in Brooklyn, NY. / Lazer bear by @DoctorDevens. / plz don't steal the bear =) | CC-BY-SA 4.0 | The PyCorder | RST | SWCLK | 3V3 | GND | SWDIO | THE PYCORDER | + - | OSO-PYCO-A1-02